# Altium project PreTriggerECAL.PrjPCB (part 2 of 3)
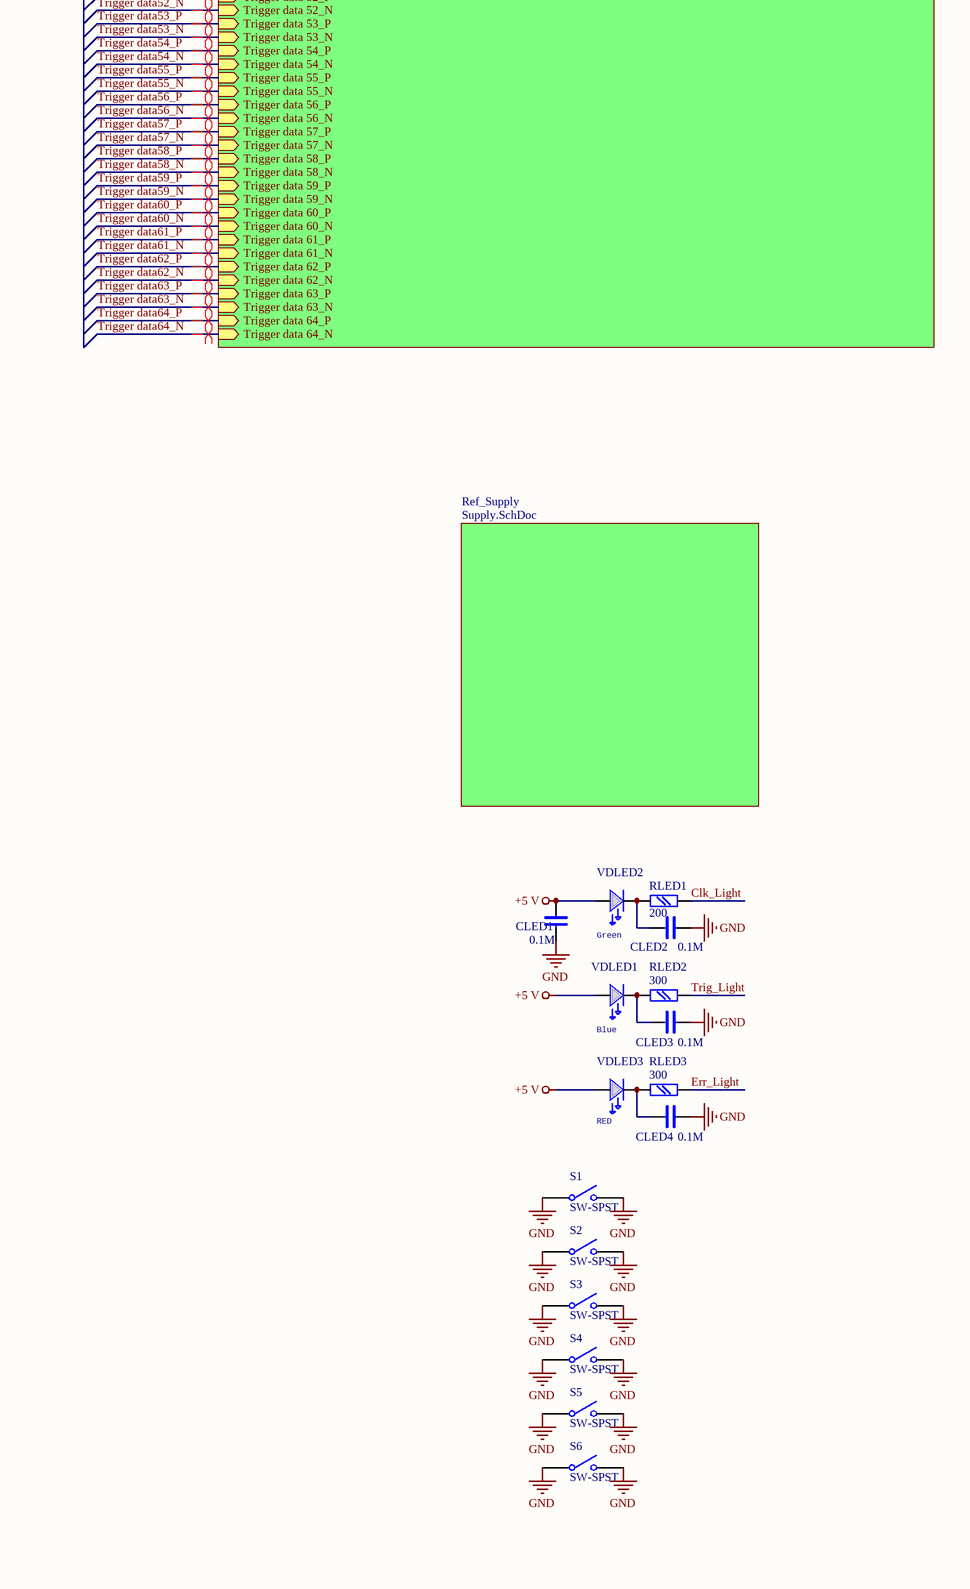
[diagram p14: Main_Trigger.SchDoc, bottom right]

## Sheet Main_Trigger.SchDoc (continued)

### Nets
+5 V: CLED1.1 VDLED1.ANOD VDLED2.ANOD VDLED3.ANOD
GND: CLED1.2 CLED2.2 CLED3.2 CLED4.2 FastTrig1.SHIELD S1.1(COMMON) S1.2(NO) S2.1(COMMON) S2.2(NO) S3.1(COMMON) S3.2(NO) S4.1(COMMON) S4.2(NO) S5.1(COMMON) S5.2(NO) S6.1(COMMON) S6.2(NO) TrigDes1.SHIELD
ADC_CLK: sheet Processing/ADC_CLK, sheet CLK/ADC_CLK
ADC_CSB: sheet Processing/ADC_CSB, sheet In_Ch1/CSB, sheet In_Ch2/CSB, sheet In_Ch3/CSB, sheet In_Ch4/CSB, sheet In_Ch5/CSB, sheet In_Ch6/CSB, sheet In_Ch7/CSB, sheet In_Ch8/CSB, sheet In_Ch9/CSB, sheet In_Ch16/CSB, sheet In_Ch15/CSB, sheet In_Ch14/CSB, sheet In_Ch13/CSB, sheet In_Ch12/CSB, sheet In_Ch11/CSB, sheet In_Ch10/CSB
ADC_DOWN_CLK_N: sheet In_Ch1/CLK_N, sheet In_Ch2/CLK_N, sheet In_Ch3/CLK_N, sheet In_Ch4/CLK_N, sheet In_Ch5/CLK_N, sheet In_Ch6/CLK_N, sheet In_Ch7/CLK_N, sheet In_Ch8/CLK_N, sheet CLK/ADC_DOWN_CLK_N
ADC_DOWN_CLK_P: sheet In_Ch1/CLK_P, sheet In_Ch2/CLK_P, sheet In_Ch3/CLK_P, sheet In_Ch4/CLK_P, sheet In_Ch5/CLK_P, sheet In_Ch6/CLK_P, sheet In_Ch7/CLK_P, sheet In_Ch8/CLK_P, sheet CLK/ADC_DOWN_CLK_P
ADC_SCLK: sheet Processing/ADC_SCLK, sheet In_Ch1/SCLK, sheet In_Ch2/SCLK, sheet In_Ch3/SCLK, sheet In_Ch4/SCLK, sheet In_Ch5/SCLK, sheet In_Ch6/SCLK, sheet In_Ch7/SCLK, sheet In_Ch8/SCLK, sheet In_Ch9/SCLK, sheet In_Ch16/SCLK, sheet In_Ch15/SCLK, sheet In_Ch14/SCLK, sheet In_Ch13/SCLK, sheet In_Ch12/SCLK, sheet In_Ch11/SCLK, sheet In_Ch10/SCLK
ADC_SDIO/ODM: sheet Processing/ADC_SDIO/ODM, sheet In_Ch1/SDIO/ODM, sheet In_Ch2/SDIO/ODM, sheet In_Ch3/SDIO/ODM, sheet In_Ch4/SDIO/ODM, sheet In_Ch5/SDIO/ODM, sheet In_Ch6/SDIO/ODM, sheet In_Ch7/SDIO/ODM, sheet In_Ch8/SDIO/ODM, sheet In_Ch9/SDIO/ODM, sheet In_Ch16/SDIO/ODM, sheet In_Ch15/SDIO/ODM, sheet In_Ch14/SDIO/ODM, sheet In_Ch13/SDIO/ODM, sheet In_Ch12/SDIO/ODM, sheet In_Ch11/SDIO/ODM, sheet In_Ch10/SDIO/ODM
ADC_UP_CLK_N: sheet In_Ch9/CLK_N, sheet In_Ch16/CLK_N, sheet In_Ch15/CLK_N, sheet In_Ch14/CLK_N, sheet In_Ch13/CLK_N, sheet In_Ch12/CLK_N, sheet In_Ch11/CLK_N, sheet In_Ch10/CLK_N, sheet CLK/ADC_UP_CLK_N
ADC_UP_CLK_P: sheet In_Ch9/CLK_P, sheet In_Ch16/CLK_P, sheet In_Ch15/CLK_P, sheet In_Ch14/CLK_P, sheet In_Ch13/CLK_P, sheet In_Ch12/CLK_P, sheet In_Ch11/CLK_P, sheet In_Ch10/CLK_P, sheet CLK/ADC_UP_CLK_P
Calib: sheet In_Ch1/Calib, sheet In_Ch2/Calib, sheet In_Ch3/Calib, sheet In_Ch4/Calib, sheet In_Ch5/Calib, sheet In_Ch6/Calib, sheet In_Ch7/Calib, sheet In_Ch8/Calib, sheet In_Ch9/Calib, sheet In_Ch16/Calib, sheet In_Ch15/Calib, sheet In_Ch14/Calib, sheet In_Ch13/Calib, sheet In_Ch12/Calib
Clk_Light: RLED1.2 ; sheet Processing/LED_Clock
COL: sheet Processing/COL, sheet Ethernet/COL
CRS: sheet Processing/CRS, sheet Ethernet/CRS
Err_Light: RLED3.2 ; sheet Processing/LED_Err
FastTrigDes: FastTrig1.WIRE ; sheet Processing/FastTrig
FCO_Next_N: sheet Processing/FCO_Next_N, sheet Next_Channels/FCO_Next_N
FCO_Next_P: sheet Processing/FCO_Next_P, sheet Next_Channels/FCO_Next_P
FCO_Prev_N: sheet Processing/FCO_Prev_N, sheet Prev_Channels/FCO_Prev_N
FCO_Prev_P: sheet Processing/FCO_Prev_P, sheet Prev_Channels/FCO_Prev_P
FCT_CLK: sheet Processing/FCT_CLK, sheet CLK/FCT_CLK
FCT_CLK_40MHz_N: sheet Processing/FCT_CLK_40MHz_N, sheet FCT_connector/FCT_CLK_40MHz_N
FCT_CLK_40MHz_P: sheet Processing/FCT_CLK_40MHz_P, sheet FCT_connector/FCT_CLK_40MHz_P
FCT_CLK_160MHz_N: sheet Processing/FCT_CLK_160MHz_N, sheet FCT_connector/FCT_CLK_160MHz_N
FCT_CLK_160MHz_P: sheet Processing/FCT_CLK_160MHz_P, sheet FCT_connector/FCT_CLK_160MHz_P
FQuartz: sheet Processing/Fquartz, sheet Ethernet/FQuartz, sheet CLK/FQuartz
NextCh1_N: sheet Processing/Next_DigCh1_N, sheet Next_Channels/TransCh1_N
NextCh1_P: sheet Processing/Next_DigCh1_P, sheet Next_Channels/TransCh1_P
NextCh2_N: sheet Processing/Next_DigCh2_N, sheet Next_Channels/TransCh2_N
NextCh2_P: sheet Processing/Next_DigCh2_P, sheet Next_Channels/TransCh2_P
NextCh3_N: sheet Processing/Next_DigCh3_N, sheet Next_Channels/TransCh3_N
NextCh3_P: sheet Processing/Next_DigCh3_P, sheet Next_Channels/TransCh3_P
NextCh4_N: sheet Processing/Next_DigCh4_N, sheet Next_Channels/TransCh4_N
NextCh4_P: sheet Processing/Next_DigCh4_P, sheet Next_Channels/TransCh4_P
NextCh5_N: sheet Processing/Next_DigCh5_N, sheet Next_Channels/TransCh5_N
NextCh5_P: sheet Processing/Next_DigCh5_P, sheet Next_Channels/TransCh5_P
NextCh6_N: sheet Processing/Next_DigCh6_N, sheet Next_Channels/TransCh6_N
NextCh6_P: sheet Processing/Next_DigCh6_P, sheet Next_Channels/TransCh6_P
NextCh7_N: sheet Processing/Next_DigCh7_N, sheet Next_Channels/TransCh7_N
NextCh7_P: sheet Processing/Next_DigCh7_P, sheet Next_Channels/TransCh7_P
NextCh8_N: sheet Processing/Next_DigCh8_N, sheet Next_Channels/TransCh8_N
NextCh8_P: sheet Processing/Next_DigCh8_P, sheet Next_Channels/TransCh8_P
NextCh9_N: sheet Processing/Next_DigCh9_N, sheet Next_Channels/TransCh9_N
NextCh9_P: sheet Processing/Next_DigCh9_P, sheet Next_Channels/TransCh9_P
NextCh10_N: sheet Processing/Next_DigCh10_N, sheet Next_Channels/TransCh10_N
NextCh10_P: sheet Processing/Next_DigCh10_P, sheet Next_Channels/TransCh10_P
NextCh11_N: sheet Processing/Next_DigCh11_N, sheet Next_Channels/TransCh11_N
NextCh11_P: sheet Processing/Next_DigCh11_P, sheet Next_Channels/TransCh11_P
NextCh12_N: sheet Processing/Next_DigCh12_N, sheet Next_Channels/TransCh12_N
NextCh12_P: sheet Processing/Next_DigCh12_P, sheet Next_Channels/TransCh12_P
Part1_InputCh1_N: sheet Processing/Part1_DigCh1_N, sheet In_Ch1/InputCh1_N
Part1_InputCh1_P: sheet Processing/Part1_DigCh1_P, sheet In_Ch1/InputCh1_P
Part1_InputCh2_N: sheet Processing/Part1_DigCh2_N, sheet In_Ch1/InputCh2_N
Part1_InputCh2_P: sheet Processing/Part1_DigCh2_P, sheet In_Ch1/InputCh2_P
Part1_InputCh3_N: sheet Processing/Part1_DigCh3_N, sheet In_Ch1/InputCh3_N
Part1_InputCh3_P: sheet Processing/Part1_DigCh3_P, sheet In_Ch1/InputCh3_P
Part1_InputCh4_N: sheet Processing/Part1_DigCh4_N, sheet In_Ch1/InputCh4_N
Part1_InputCh4_P: sheet Processing/Part1_DigCh4_P, sheet In_Ch1/InputCh4_P
Part1_InputCh5_N: sheet Processing/Part1_DigCh5_N, sheet In_Ch1/InputCh5_N
Part1_InputCh5_P: sheet Processing/Part1_DigCh5_P, sheet In_Ch1/InputCh5_P
Part1_InputCh6_N: sheet Processing/Part1_DigCh6_N, sheet In_Ch1/InputCh6_N
Part1_InputCh6_P: sheet Processing/Part1_DigCh6_P, sheet In_Ch1/InputCh6_P
Part1_InputCh7_N: sheet Processing/Part1_DigCh7_N, sheet In_Ch1/InputCh7_N
Part1_InputCh7_P: sheet Processing/Part1_DigCh7_P, sheet In_Ch1/InputCh7_P
Part1_InputCh8_N: sheet Processing/Part1_DigCh8_N, sheet In_Ch1/InputCh8_N
Part1_InputCh8_P: sheet Processing/Part1_DigCh8_P, sheet In_Ch1/InputCh8_P
Part2_InputCh1_N: sheet Processing/Part2_DigCh1_N, sheet In_Ch2/InputCh1_N
Part2_InputCh1_P: sheet Processing/Part2_DigCh1_P, sheet In_Ch2/InputCh1_P
Part2_InputCh2_N: sheet Processing/Part2_DigCh2_N, sheet In_Ch2/InputCh2_N
Part2_InputCh2_P: sheet Processing/Part2_DigCh2_P, sheet In_Ch2/InputCh2_P
Part2_InputCh3_N: sheet Processing/Part2_DigCh3_N, sheet In_Ch2/InputCh3_N
Part2_InputCh3_P: sheet Processing/Part2_DigCh3_P, sheet In_Ch2/InputCh3_P
Part2_InputCh4_N: sheet Processing/Part2_DigCh4_N, sheet In_Ch2/InputCh4_N
Part2_InputCh4_P: sheet Processing/Part2_DigCh4_P, sheet In_Ch2/InputCh4_P
Part2_InputCh5_N: sheet Processing/Part2_DigCh5_N, sheet In_Ch2/InputCh5_N
Part2_InputCh5_P: sheet Processing/Part2_DigCh5_P, sheet In_Ch2/InputCh5_P
Part2_InputCh6_N: sheet Processing/Part2_DigCh6_N, sheet In_Ch2/InputCh6_N
Part2_InputCh6_P: sheet Processing/Part2_DigCh6_P, sheet In_Ch2/InputCh6_P
Part2_InputCh7_N: sheet Processing/Part2_DigCh7_N, sheet In_Ch2/InputCh7_N
Part2_InputCh7_P: sheet Processing/Part2_DigCh7_P, sheet In_Ch2/InputCh7_P
Part2_InputCh8_N: sheet Processing/Part2_DigCh8_N, sheet In_Ch2/InputCh8_N
Part2_InputCh8_P: sheet Processing/Part2_DigCh8_P, sheet In_Ch2/InputCh8_P
Part3_InputCh1_N: sheet Processing/Part3_DigCh1_N, sheet In_Ch3/InputCh1_N
Part3_InputCh1_P: sheet Processing/Part3_DigCh1_P, sheet In_Ch3/InputCh1_P
Part3_InputCh2_N: sheet Processing/Part3_DigCh2_N, sheet In_Ch3/InputCh2_N
Part3_InputCh2_P: sheet Processing/Part3_DigCh2_P, sheet In_Ch3/InputCh2_P
Part3_InputCh3_N: sheet Processing/Part3_DigCh3_N, sheet In_Ch3/InputCh3_N
Part3_InputCh3_P: sheet Processing/Part3_DigCh3_P, sheet In_Ch3/InputCh3_P
Part3_InputCh4_N: sheet Processing/Part3_DigCh4_N, sheet In_Ch3/InputCh4_N
Part3_InputCh4_P: sheet Processing/Part3_DigCh4_P, sheet In_Ch3/InputCh4_P
Part3_InputCh5_N: sheet Processing/Part3_DigCh5_N, sheet In_Ch3/InputCh5_N
Part3_InputCh5_P: sheet Processing/Part3_DigCh5_P, sheet In_Ch3/InputCh5_P
Part3_InputCh6_N: sheet Processing/Part3_DigCh6_N, sheet In_Ch3/InputCh6_N
Part3_InputCh6_P: sheet Processing/Part3_DigCh6_P, sheet In_Ch3/InputCh6_P
Part3_InputCh7_N: sheet Processing/Part3_DigCh7_N, sheet In_Ch3/InputCh7_N
Part3_InputCh7_P: sheet Processing/Part3_DigCh7_P, sheet In_Ch3/InputCh7_P
Part3_InputCh8_N: sheet Processing/Part3_DigCh8_N, sheet In_Ch3/InputCh8_N
Part3_InputCh8_P: sheet Processing/Part3_DigCh8_P, sheet In_Ch3/InputCh8_P
Part4_InputCh1_N: sheet Processing/Part4_DigCh1_N, sheet In_Ch4/InputCh1_N
Part4_InputCh1_P: sheet Processing/Part4_DigCh1_P, sheet In_Ch4/InputCh1_P
Part4_InputCh2_N: sheet Processing/Part4_DigCh2_N, sheet In_Ch4/InputCh2_N
Part4_InputCh2_P: sheet Processing/Part4_DigCh2_P, sheet In_Ch4/InputCh2_P
Part4_InputCh3_N: sheet Processing/Part4_DigCh3_N, sheet In_Ch4/InputCh3_N
Part4_InputCh3_P: sheet Processing/Part4_DigCh3_P, sheet In_Ch4/InputCh3_P
Part4_InputCh4_N: sheet Processing/Part4_DigCh4_N, sheet In_Ch4/InputCh4_N
Part4_InputCh4_P: sheet Processing/Part4_DigCh4_P, sheet In_Ch4/InputCh4_P
Part4_InputCh5_N: sheet Processing/Part4_DigCh5_N, sheet In_Ch4/InputCh5_N
Part4_InputCh5_P: sheet Processing/Part4_DigCh5_P, sheet In_Ch4/InputCh5_P
Part4_InputCh6_N: sheet Processing/Part4_DigCh6_N, sheet In_Ch4/InputCh6_N
Part4_InputCh6_P: sheet Processing/Part4_DigCh6_P, sheet In_Ch4/InputCh6_P
Part4_InputCh7_N: sheet Processing/Part4_DigCh7_N, sheet In_Ch4/InputCh7_N
Part4_InputCh7_P: sheet Processing/Part4_DigCh7_P, sheet In_Ch4/InputCh7_P
Part4_InputCh8_N: sheet Processing/Part4_DigCh8_N, sheet In_Ch4/InputCh8_N
Part4_InputCh8_P: sheet Processing/Part4_DigCh8_P, sheet In_Ch4/InputCh8_P
Part5_InputCh1_N: sheet Processing/Part5_DigCh1_N, sheet In_Ch5/InputCh1_N
Part5_InputCh1_P: sheet Processing/Part5_DigCh1_P, sheet In_Ch5/InputCh1_P
Part5_InputCh2_N: sheet Processing/Part5_DigCh2_N, sheet In_Ch5/InputCh2_N
Part5_InputCh2_P: sheet Processing/Part5_DigCh2_P, sheet In_Ch5/InputCh2_P
Part5_InputCh3_N: sheet Processing/Part5_DigCh3_N, sheet In_Ch5/InputCh3_N
Part5_InputCh3_P: sheet Processing/Part5_DigCh3_P, sheet In_Ch5/InputCh3_P
Part5_InputCh4_N: sheet Processing/Part5_DigCh4_N, sheet In_Ch5/InputCh4_N
Part5_InputCh4_P: sheet Processing/Part5_DigCh4_P, sheet In_Ch5/InputCh4_P
Part5_InputCh5_N: sheet Processing/Part5_DigCh5_N, sheet In_Ch5/InputCh5_N
Part5_InputCh5_P: sheet Processing/Part5_DigCh5_P, sheet In_Ch5/InputCh5_P
Part5_InputCh6_N: sheet Processing/Part5_DigCh6_N, sheet In_Ch5/InputCh6_N
Part5_InputCh6_P: sheet Processing/Part5_DigCh6_P, sheet In_Ch5/InputCh6_P
Part5_InputCh7_N: sheet Processing/Part5_DigCh7_N, sheet In_Ch5/InputCh7_N
Part5_InputCh7_P: sheet Processing/Part5_DigCh7_P, sheet In_Ch5/InputCh7_P
Part5_InputCh8_N: sheet Processing/Part5_DigCh8_N, sheet In_Ch5/InputCh8_N
Part5_InputCh8_P: sheet Processing/Part5_DigCh8_P, sheet In_Ch5/InputCh8_P
Part6_InputCh1_N: sheet Processing/Part6_DigCh1_N, sheet In_Ch6/InputCh1_N
Part6_InputCh1_P: sheet Processing/Part6_DigCh1_P, sheet In_Ch6/InputCh1_P
Part6_InputCh2_N: sheet Processing/Part6_DigCh2_N, sheet In_Ch6/InputCh2_N
Part6_InputCh2_P: sheet Processing/Part6_DigCh2_P, sheet In_Ch6/InputCh2_P
Part6_InputCh3_N: sheet Processing/Part6_DigCh3_N, sheet In_Ch6/InputCh3_N
Part6_InputCh3_P: sheet Processing/Part6_DigCh3_P, sheet In_Ch6/InputCh3_P
Part6_InputCh4_N: sheet Processing/Part6_DigCh4_N, sheet In_Ch6/InputCh4_N
Part6_InputCh4_P: sheet Processing/Part6_DigCh4_P, sheet In_Ch6/InputCh4_P
Part6_InputCh5_N: sheet Processing/Part6_DigCh5_N, sheet In_Ch6/InputCh5_N
Part6_InputCh5_P: sheet Processing/Part6_DigCh5_P, sheet In_Ch6/InputCh5_P
Part6_InputCh6_N: sheet Processing/Part6_DigCh6_N, sheet In_Ch6/InputCh6_N
Part6_InputCh6_P: sheet Processing/Part6_DigCh6_P, sheet In_Ch6/InputCh6_P
Part6_InputCh7_N: sheet Processing/Part6_DigCh7_N, sheet In_Ch6/InputCh7_N
Part6_InputCh7_P: sheet Processing/Part6_DigCh7_P, sheet In_Ch6/InputCh7_P
Part6_InputCh8_N: sheet Processing/Part6_DigCh8_N, sheet In_Ch6/InputCh8_N
Part6_InputCh8_P: sheet Processing/Part6_DigCh8_P, sheet In_Ch6/InputCh8_P
Part7_InputCh1_N: sheet Processing/Part7_DigCh1_N, sheet In_Ch7/InputCh1_N
Part7_InputCh1_P: sheet Processing/Part7_DigCh1_P, sheet In_Ch7/InputCh1_P
Part7_InputCh2_N: sheet Processing/Part7_DigCh2_N, sheet In_Ch7/InputCh2_N
Part7_InputCh2_P: sheet Processing/Part7_DigCh2_P, sheet In_Ch7/InputCh2_P
Part7_InputCh3_N: sheet Processing/Part7_DigCh3_N, sheet In_Ch7/InputCh3_N
Part7_InputCh3_P: sheet Processing/Part7_DigCh3_P, sheet In_Ch7/InputCh3_P
Part7_InputCh4_N: sheet Processing/Part7_DigCh4_N, sheet In_Ch7/InputCh4_N
Part7_InputCh4_P: sheet Processing/Part7_DigCh4_P, sheet In_Ch7/InputCh4_P
Part7_InputCh5_N: sheet Processing/Part7_DigCh5_N, sheet In_Ch7/InputCh5_N
Part7_InputCh5_P: sheet Processing/Part7_DigCh5_P, sheet In_Ch7/InputCh5_P
Part7_InputCh6_N: sheet Processing/Part7_DigCh6_N, sheet In_Ch7/InputCh6_N
Part7_InputCh6_P: sheet Processing/Part7_DigCh6_P, sheet In_Ch7/InputCh6_P
Part7_InputCh7_N: sheet Processing/Part7_DigCh7_N, sheet In_Ch7/InputCh7_N
Part7_InputCh7_P: sheet Processing/Part7_DigCh7_P, sheet In_Ch7/InputCh7_P
Part7_InputCh8_N: sheet Processing/Part7_DigCh8_N, sheet In_Ch7/InputCh8_N
Part7_InputCh8_P: sheet Processing/Part7_DigCh8_P, sheet In_Ch7/InputCh8_P
Part8_InputCh1_N: sheet Processing/Part8_DigCh1_N, sheet In_Ch8/InputCh1_N
Part8_InputCh1_P: sheet Processing/Part8_DigCh1_P, sheet In_Ch8/InputCh1_P
Part8_InputCh2_N: sheet Processing/Part8_DigCh2_N, sheet In_Ch8/InputCh2_N
Part8_InputCh2_P: sheet Processing/Part8_DigCh2_P, sheet In_Ch8/InputCh2_P
Part8_InputCh3_N: sheet Processing/Part8_DigCh3_N, sheet In_Ch8/InputCh3_N
Part8_InputCh3_P: sheet Processing/Part8_DigCh3_P, sheet In_Ch8/InputCh3_P
Part8_InputCh4_N: sheet Processing/Part8_DigCh4_N, sheet In_Ch8/InputCh4_N
Part8_InputCh4_P: sheet Processing/Part8_DigCh4_P, sheet In_Ch8/InputCh4_P
Part8_InputCh5_N: sheet Processing/Part8_DigCh5_N, sheet In_Ch8/InputCh5_N
Part8_InputCh5_P: sheet Processing/Part8_DigCh5_P, sheet In_Ch8/InputCh5_P
Part8_InputCh6_N: sheet Processing/Part8_DigCh6_N, sheet In_Ch8/InputCh6_N
Part8_InputCh6_P: sheet Processing/Part8_DigCh6_P, sheet In_Ch8/InputCh6_P
Part8_InputCh7_N: sheet Processing/Part8_DigCh7_N, sheet In_Ch8/InputCh7_N
Part8_InputCh7_P: sheet Processing/Part8_DigCh7_P, sheet In_Ch8/InputCh7_P
Part8_InputCh8_N: sheet Processing/Part8_DigCh8_N, sheet In_Ch8/InputCh8_N
Part8_InputCh8_P: sheet Processing/Part8_DigCh8_P, sheet In_Ch8/InputCh8_P
Part9_InputCh1_N: sheet Processing/Part9_DigCh1_N, sheet In_Ch9/InputCh1_N
Part9_InputCh1_P: sheet Processing/Part9_DigCh1_P, sheet In_Ch9/InputCh1_P
Part9_InputCh2_N: sheet Processing/Part9_DigCh2_N, sheet In_Ch9/InputCh2_N
Part9_InputCh2_P: sheet Processing/Part9_DigCh2_P, sheet In_Ch9/InputCh2_P
Part9_InputCh3_N: sheet Processing/Part9_DigCh3_N, sheet In_Ch9/InputCh3_N
Part9_InputCh3_P: sheet Processing/Part9_DigCh3_P, sheet In_Ch9/InputCh3_P
Part9_InputCh4_N: sheet Processing/Part9_DigCh4_N, sheet In_Ch9/InputCh4_N
Part9_InputCh4_P: sheet Processing/Part9_DigCh4_P, sheet In_Ch9/InputCh4_P
Part9_InputCh5_N: sheet Processing/Part9_DigCh5_N, sheet In_Ch9/InputCh5_N
Part9_InputCh5_P: sheet Processing/Part9_DigCh5_P, sheet In_Ch9/InputCh5_P
Part9_InputCh6_N: sheet Processing/Part9_DigCh6_N, sheet In_Ch9/InputCh6_N
Part9_InputCh6_P: sheet Processing/Part9_DigCh6_P, sheet In_Ch9/InputCh6_P
Part9_InputCh7_N: sheet Processing/Part9_DigCh7_N, sheet In_Ch9/InputCh7_N
Part9_InputCh7_P: sheet Processing/Part9_DigCh7_P, sheet In_Ch9/InputCh7_P
Part9_InputCh8_N: sheet Processing/Part9_DigCh8_N, sheet In_Ch9/InputCh8_N
Part9_InputCh8_P: sheet Processing/Part9_DigCh8_P, sheet In_Ch9/InputCh8_P
Part10_InputCh1_N: sheet Processing/Part10_DigCh1_N, sheet In_Ch10/InputCh1_N
Part10_InputCh1_P: sheet Processing/Part10_DigCh1_P, sheet In_Ch10/InputCh1_P
Part10_InputCh2_N: sheet Processing/Part10_DigCh2_N, sheet In_Ch10/InputCh2_N
Part10_InputCh2_P: sheet Processing/Part10_DigCh2_P, sheet In_Ch10/InputCh2_P
Part10_InputCh3_N: sheet Processing/Part10_DigCh3_N, sheet In_Ch10/InputCh3_N
Part10_InputCh3_P: sheet Processing/Part10_DigCh3_P, sheet In_Ch10/InputCh3_P
Part10_InputCh4_N: sheet Processing/Part10_DigCh4_N, sheet In_Ch10/InputCh4_N
Part10_InputCh4_P: sheet Processing/Part10_DigCh4_P, sheet In_Ch10/InputCh4_P
Part10_InputCh5_N: sheet Processing/Part10_DigCh5_N, sheet In_Ch10/InputCh5_N
Part10_InputCh5_P: sheet Processing/Part10_DigCh5_P, sheet In_Ch10/InputCh5_P
Part10_InputCh6_N: sheet Processing/Part10_DigCh6_N, sheet In_Ch10/InputCh6_N
Part10_InputCh6_P: sheet Processing/Part10_DigCh6_P, sheet In_Ch10/InputCh6_P
Part10_InputCh7_N: sheet Processing/Part10_DigCh7_N, sheet In_Ch10/InputCh7_N
Part10_InputCh7_P: sheet Processing/Part10_DigCh7_P, sheet In_Ch10/InputCh7_P
Part10_InputCh8_N: sheet Processing/Part10_DigCh8_N, sheet In_Ch10/InputCh8_N
Part10_InputCh8_P: sheet Processing/Part10_DigCh8_P, sheet In_Ch10/InputCh8_P
Part11_InputCh1_N: sheet Processing/Part11_DigCh1_N, sheet In_Ch11/InputCh1_N
Part11_InputCh1_P: sheet Processing/Part11_DigCh1_P, sheet In_Ch11/InputCh1_P
Part11_InputCh2_N: sheet Processing/Part11_DigCh2_N, sheet In_Ch11/InputCh2_N
Part11_InputCh2_P: sheet Processing/Part11_DigCh2_P, sheet In_Ch11/InputCh2_P
Part11_InputCh3_N: sheet Processing/Part11_DigCh3_N, sheet In_Ch11/InputCh3_N
Part11_InputCh3_P: sheet Processing/Part11_DigCh3_P, sheet In_Ch11/InputCh3_P
Part11_InputCh4_N: sheet Processing/Part11_DigCh4_N, sheet In_Ch11/InputCh4_N
Part11_InputCh4_P: sheet Processing/Part11_DigCh4_P, sheet In_Ch11/InputCh4_P
Part11_InputCh5_N: sheet Processing/Part11_DigCh5_N, sheet In_Ch11/InputCh5_N
Part11_InputCh5_P: sheet Processing/Part11_DigCh5_P, sheet In_Ch11/InputCh5_P
Part11_InputCh6_N: sheet Processing/Part11_DigCh6_N, sheet In_Ch11/InputCh6_N
Part11_InputCh6_P: sheet Processing/Part11_DigCh6_P, sheet In_Ch11/InputCh6_P
Part11_InputCh7_N: sheet Processing/Part11_DigCh7_N, sheet In_Ch11/InputCh7_N
Part11_InputCh7_P: sheet Processing/Part11_DigCh7_P, sheet In_Ch11/InputCh7_P
Part11_InputCh8_N: sheet Processing/Part11_DigCh8_N, sheet In_Ch11/InputCh8_N
Part11_InputCh8_P: sheet Processing/Part11_DigCh8_P, sheet In_Ch11/InputCh8_P
Part12_InputCh1_N: sheet Processing/Part12_DigCh1_N, sheet In_Ch12/InputCh1_N
Part12_InputCh1_P: sheet Processing/Part12_DigCh1_P, sheet In_Ch12/InputCh1_P
Part12_InputCh2_N: sheet Processing/Part12_DigCh2_N, sheet In_Ch12/InputCh2_N
Part12_InputCh2_P: sheet Processing/Part12_DigCh2_P, sheet In_Ch12/InputCh2_P
Part12_InputCh3_N: sheet Processing/Part12_DigCh3_N, sheet In_Ch12/InputCh3_N
Part12_InputCh3_P: sheet Processing/Part12_DigCh3_P, sheet In_Ch12/InputCh3_P
Part12_InputCh4_N: sheet Processing/Part12_DigCh4_N, sheet In_Ch12/InputCh4_N
Part12_InputCh4_P: sheet Processing/Part12_DigCh4_P, sheet In_Ch12/InputCh4_P
Part12_InputCh5_N: sheet Processing/Part12_DigCh5_N, sheet In_Ch12/InputCh5_N
Part12_InputCh5_P: sheet Processing/Part12_DigCh5_P, sheet In_Ch12/InputCh5_P
Part12_InputCh6_N: sheet Processing/Part12_DigCh6_N, sheet In_Ch12/InputCh6_N
Part12_InputCh6_P: sheet Processing/Part12_DigCh6_P, sheet In_Ch12/InputCh6_P
Part12_InputCh7_N: sheet Processing/Part12_DigCh7_N, sheet In_Ch12/InputCh7_N
Part12_InputCh7_P: sheet Processing/Part12_DigCh7_P, sheet In_Ch12/InputCh7_P
Part12_InputCh8_N: sheet Processing/Part12_DigCh8_N, sheet In_Ch12/InputCh8_N
Part12_InputCh8_P: sheet Processing/Part12_DigCh8_P, sheet In_Ch12/InputCh8_P
Part13_InputCh1_N: sheet Processing/Part13_DigCh1_N, sheet In_Ch13/InputCh1_N
Part13_InputCh1_P: sheet Processing/Part13_DigCh1_P, sheet In_Ch13/InputCh1_P
Part13_InputCh2_N: sheet Processing/Part13_DigCh2_N, sheet In_Ch13/InputCh2_N
Part13_InputCh2_P: sheet Processing/Part13_DigCh2_P, sheet In_Ch13/InputCh2_P
Part13_InputCh3_N: sheet Processing/Part13_DigCh3_N, sheet In_Ch13/InputCh3_N
Part13_InputCh3_P: sheet Processing/Part13_DigCh3_P, sheet In_Ch13/InputCh3_P
Part13_InputCh4_N: sheet Processing/Part13_DigCh4_N, sheet In_Ch13/InputCh4_N
Part13_InputCh4_P: sheet Processing/Part13_DigCh4_P, sheet In_Ch13/InputCh4_P
Part13_InputCh5_N: sheet Processing/Part13_DigCh5_N, sheet In_Ch13/InputCh5_N
Part13_InputCh5_P: sheet Processing/Part13_DigCh5_P, sheet In_Ch13/InputCh5_P
Part13_InputCh6_N: sheet Processing/Part13_DigCh6_N, sheet In_Ch13/InputCh6_N
Part13_InputCh6_P: sheet Processing/Part13_DigCh6_P, sheet In_Ch13/InputCh6_P
Part13_InputCh7_N: sheet Processing/Part13_DigCh7_N, sheet In_Ch13/InputCh7_N
Part13_InputCh7_P: sheet Processing/Part13_DigCh7_P, sheet In_Ch13/InputCh7_P
Part13_InputCh8_N: sheet Processing/Part13_DigCh8_N, sheet In_Ch13/InputCh8_N
Part13_InputCh8_P: sheet Processing/Part13_DigCh8_P, sheet In_Ch13/InputCh8_P
Part14_InputCh1_N: sheet Processing/Part14_DigCh1_N, sheet In_Ch14/InputCh1_N
Part14_InputCh1_P: sheet Processing/Part14_DigCh1_P, sheet In_Ch14/InputCh1_P
Part14_InputCh2_N: sheet Processing/Part14_DigCh2_N, sheet In_Ch14/InputCh2_N
Part14_InputCh2_P: sheet Processing/Part14_DigCh2_P, sheet In_Ch14/InputCh2_P
Part14_InputCh3_N: sheet Processing/Part14_DigCh3_N, sheet In_Ch14/InputCh3_N
Part14_InputCh3_P: sheet Processing/Part14_DigCh3_P, sheet In_Ch14/InputCh3_P
Part14_InputCh4_N: sheet Processing/Part14_DigCh4_N, sheet In_Ch14/InputCh4_N
Part14_InputCh4_P: sheet Processing/Part14_DigCh4_P, sheet In_Ch14/InputCh4_P
Part14_InputCh5_N: sheet Processing/Part14_DigCh5_N, sheet In_Ch14/InputCh5_N
Part14_InputCh5_P: sheet Processing/Part14_DigCh5_P, sheet In_Ch14/InputCh5_P
Part14_InputCh6_N: sheet Processing/Part14_DigCh6_N, sheet In_Ch14/InputCh6_N
Part14_InputCh6_P: sheet Processing/Part14_DigCh6_P, sheet In_Ch14/InputCh6_P
Part14_InputCh7_N: sheet Processing/Part14_DigCh7_N, sheet In_Ch14/InputCh7_N
Part14_InputCh7_P: sheet Processing/Part14_DigCh7_P, sheet In_Ch14/InputCh7_P
Part14_InputCh8_N: sheet Processing/Part14_DigCh8_N, sheet In_Ch14/InputCh8_N
Part14_InputCh8_P: sheet Processing/Part14_DigCh8_P, sheet In_Ch14/InputCh8_P
Part15_InputCh1_N: sheet Processing/Part15_DigCh1_N, sheet In_Ch15/InputCh1_N
Part15_InputCh1_P: sheet Processing/Part15_DigCh1_P, sheet In_Ch15/InputCh1_P
Part15_InputCh2_N: sheet Processing/Part15_DigCh2_N, sheet In_Ch15/InputCh2_N
Part15_InputCh2_P: sheet Processing/Part15_DigCh2_P, sheet In_Ch15/InputCh2_P
Part15_InputCh3_N: sheet Processing/Part15_DigCh3_N, sheet In_Ch15/InputCh3_N
Part15_InputCh3_P: sheet Processing/Part15_DigCh3_P, sheet In_Ch15/InputCh3_P
Part15_InputCh4_N: sheet Processing/Part15_DigCh4_N, sheet In_Ch15/InputCh4_N
Part15_InputCh4_P: sheet Processing/Part15_DigCh4_P, sheet In_Ch15/InputCh4_P
Part15_InputCh5_N: sheet Processing/Part15_DigCh5_N, sheet In_Ch15/InputCh5_N
Part15_InputCh5_P: sheet Processing/Part15_DigCh5_P, sheet In_Ch15/InputCh5_P
Part15_InputCh6_N: sheet Processing/Part15_DigCh6_N, sheet In_Ch15/InputCh6_N
Part15_InputCh6_P: sheet Processing/Part15_DigCh6_P, sheet In_Ch15/InputCh6_P
Part15_InputCh7_N: sheet Processing/Part15_DigCh7_N, sheet In_Ch15/InputCh7_N
Part15_InputCh7_P: sheet Processing/Part15_DigCh7_P, sheet In_Ch15/InputCh7_P
Part15_InputCh8_N: sheet Processing/Part15_DigCh8_N, sheet In_Ch15/InputCh8_N
Part15_InputCh8_P: sheet Processing/Part15_DigCh8_P, sheet In_Ch15/InputCh8_P
Part16_InputCh1_N: sheet Processing/Part16_DigCh1_N, sheet In_Ch16/InputCh1_N
Part16_InputCh1_P: sheet Processing/Part16_DigCh1_P, sheet In_Ch16/InputCh1_P
Part16_InputCh2_N: sheet Processing/Part16_DigCh2_N, sheet In_Ch16/InputCh2_N
Part16_InputCh2_P: sheet Processing/Part16_DigCh2_P, sheet In_Ch16/InputCh2_P
Part16_InputCh3_N: sheet Processing/Part16_DigCh3_N, sheet In_Ch16/InputCh3_N
Part16_InputCh3_P: sheet Processing/Part16_DigCh3_P, sheet In_Ch16/InputCh3_P
Part16_InputCh4_N: sheet Processing/Part16_DigCh4_N, sheet In_Ch16/InputCh4_N
Part16_InputCh4_P: sheet Processing/Part16_DigCh4_P, sheet In_Ch16/InputCh4_P
Part16_InputCh5_N: sheet Processing/Part16_DigCh5_N, sheet In_Ch16/InputCh5_N
Part16_InputCh5_P: sheet Processing/Part16_DigCh5_P, sheet In_Ch16/InputCh5_P
Part16_InputCh6_N: sheet Processing/Part16_DigCh6_N, sheet In_Ch16/InputCh6_N
Part16_InputCh6_P: sheet Processing/Part16_DigCh6_P, sheet In_Ch16/InputCh6_P
Part16_InputCh7_N: sheet Processing/Part16_DigCh7_N, sheet In_Ch16/InputCh7_N
Part16_InputCh7_P: sheet Processing/Part16_DigCh7_P, sheet In_Ch16/InputCh7_P
Part16_InputCh8_N: sheet Processing/Part16_DigCh8_N, sheet In_Ch16/InputCh8_N
Part16_InputCh8_P: sheet Processing/Part16_DigCh8_P, sheet In_Ch16/InputCh8_P
PLL_CLK: sheet Processing/PLL_CLK, sheet CLK/PLL_CLK
PrevCh1_N: sheet Processing/Prev_DigCh1_N, sheet Prev_Channels/TransCh1_N
PrevCh1_P: sheet Processing/Prev_DigCh1_P, sheet Prev_Channels/TransCh1_P
PrevCh2_N: sheet Processing/Prev_DigCh2_N, sheet Prev_Channels/TransCh2_N
PrevCh2_P: sheet Processing/Prev_DigCh2_P, sheet Prev_Channels/TransCh2_P
PrevCh3_N: sheet Processing/Prev_DigCh3_N, sheet Prev_Channels/TransCh3_N
PrevCh3_P: sheet Processing/Prev_DigCh3_P, sheet Prev_Channels/TransCh3_P
PrevCh4_N: sheet Processing/Prev_DigCh4_N, sheet Prev_Channels/TransCh4_N
PrevCh4_P: sheet Processing/Prev_DigCh4_P, sheet Prev_Channels/TransCh4_P
PrevCh5_N: sheet Processing/Prev_DigCh5_N, sheet Prev_Channels/TransCh5_N
PrevCh5_P: sheet Processing/Prev_DigCh5_P, sheet Prev_Channels/TransCh5_P
PrevCh6_N: sheet Processing/Prev_DigCh6_N, sheet Prev_Channels/TransCh6_N
PrevCh6_P: sheet Processing/Prev_DigCh6_P, sheet Prev_Channels/TransCh6_P
PrevCh7_N: sheet Processing/Prev_DigCh7_N, sheet Prev_Channels/TransCh7_N
PrevCh7_P: sheet Processing/Prev_DigCh7_P, sheet Prev_Channels/TransCh7_P
PrevCh8_N: sheet Processing/Prev_DigCh8_N, sheet Prev_Channels/TransCh8_N
PrevCh8_P: sheet Processing/Prev_DigCh8_P, sheet Prev_Channels/TransCh8_P
PrevCh9_N: sheet Processing/Prev_DigCh9_N, sheet Prev_Channels/TransCh9_N
PrevCh9_P: sheet Processing/Prev_DigCh9_P, sheet Prev_Channels/TransCh9_P
PrevCh10_N: sheet Processing/Prev_DigCh10_N, sheet Prev_Channels/TransCh10_N
PrevCh10_P: sheet Processing/Prev_DigCh10_P, sheet Prev_Channels/TransCh10_P
PrevCh11_N: sheet Processing/Prev_DigCh11_N, sheet Prev_Channels/TransCh11_N
PrevCh11_P: sheet Processing/Prev_DigCh11_P, sheet Prev_Channels/TransCh11_P
PrevCh12_N: sheet Processing/Prev_DigCh12_N, sheet Prev_Channels/TransCh12_N
PrevCh12_P: sheet Processing/Prev_DigCh12_P, sheet Prev_Channels/TransCh12_P
RX_CLK: sheet Processing/RX_CLK, sheet Ethernet/RX_CLK
RX_DV: sheet Processing/RX_DV, sheet Ethernet/RX_DV
SW_FCT-CLK: sheet Processing/SW_FCT-CLK, sheet CLK/SW_FCT-CLK
SW_Quartz: sheet Processing/SW_Quartz, sheet CLK/SW_Quartz
Trig_Light: RLED2.2 ; sheet Processing/LED_Trig
TrigDes: TrigDes1.WIRE ; sheet Processing/TrigDes
Trigger data1_N: sheet Processing/Trigger data 1_N, sheet FCT_connector/Trigger data 1_N
Trigger data1_P: sheet Processing/Trigger data 1_P, sheet FCT_connector/Trigger data 1_P
Trigger data2_N: sheet Processing/Trigger data 2_N, sheet FCT_connector/Trigger data 2_N
Trigger data2_P: sheet Processing/Trigger data 2_P, sheet FCT_connector/Trigger data 2_P
Trigger data3_N: sheet Processing/Trigger data 3_N, sheet FCT_connector/Trigger data 3_N
Trigger data3_P: sheet Processing/Trigger data 3_P, sheet FCT_connector/Trigger data 3_P
Trigger data4_N: sheet Processing/Trigger data 4_N, sheet FCT_connector/Trigger data 4_N
Trigger data4_P: sheet Processing/Trigger data 4_P, sheet FCT_connector/Trigger data 4_P
Trigger data5_N: sheet Processing/Trigger data 5_N, sheet FCT_connector/Trigger data 5_N
Trigger data5_P: sheet Processing/Trigger data 5_P, sheet FCT_connector/Trigger data 5_P
Trigger data6_N: sheet Processing/Trigger data 6_N, sheet FCT_connector/Trigger data 6_N
Trigger data6_P: sheet Processing/Trigger data 6_P, sheet FCT_connector/Trigger data 6_P
Trigger data7_N: sheet Processing/Trigger data 7_N, sheet FCT_connector/Trigger data 7_N
Trigger data7_P: sheet Processing/Trigger data 7_P, sheet FCT_connector/Trigger data 7_P
Trigger data8_N: sheet Processing/Trigger data 8_N, sheet FCT_connector/Trigger data 8_N
Trigger data8_P: sheet Processing/Trigger data 8_P, sheet FCT_connector/Trigger data 8_P
Trigger data9_N: sheet Processing/Trigger data 9_N, sheet FCT_connector/Trigger data 9_N
Trigger data9_P: sheet Processing/Trigger data 9_P, sheet FCT_connector/Trigger data 9_P
Trigger data10_N: sheet Processing/Trigger data 10_N, sheet FCT_connector/Trigger data 10_N
Trigger data10_P: sheet Processing/Trigger data 10_P, sheet FCT_connector/Trigger data 10_P
Trigger data11_N: sheet Processing/Trigger data 11_N, sheet FCT_connector/Trigger data 11_N
Trigger data11_P: sheet Processing/Trigger data 11_P, sheet FCT_connector/Trigger data 11_P
Trigger data12_N: sheet Processing/Trigger data 12_N, sheet FCT_connector/Trigger data 12_N
Trigger data12_P: sheet Processing/Trigger data 12_P, sheet FCT_connector/Trigger data 12_P
Trigger data13_N: sheet Processing/Trigger data 13_N, sheet FCT_connector/Trigger data 13_N
Trigger data13_P: sheet Processing/Trigger data 13_P, sheet FCT_connector/Trigger data 13_P
Trigger data14_N: sheet Processing/Trigger data 14_N, sheet FCT_connector/Trigger data 14_N
Trigger data14_P: sheet Processing/Trigger data 14_P, sheet FCT_connector/Trigger data 14_P
Trigger data15_N: sheet Processing/Trigger data 15_N, sheet FCT_connector/Trigger data 15_N
Trigger data15_P: sheet Processing/Trigger data 15_P, sheet FCT_connector/Trigger data 15_P
Trigger data16_N: sheet Processing/Trigger data 16_N, sheet FCT_connector/Trigger data 16_N
Trigger data16_P: sheet Processing/Trigger data 16_P, sheet FCT_connector/Trigger data 16_P
Trigger data17_N: sheet Processing/Trigger data 17_N, sheet FCT_connector/Trigger data 17_N
Trigger data17_P: sheet Processing/Trigger data 17_P, sheet FCT_connector/Trigger data 17_P
Trigger data18_N: sheet Processing/Trigger data 18_N, sheet FCT_connector/Trigger data 18_N
Trigger data18_P: sheet Processing/Trigger data 18_P, sheet FCT_connector/Trigger data 18_P
Trigger data19_N: sheet Processing/Trigger data 19_N, sheet FCT_connector/Trigger data 19_N
Trigger data19_P: sheet Processing/Trigger data 19_P, sheet FCT_connector/Trigger data 19_P
Trigger data20_N: sheet Processing/Trigger data 20_N, sheet FCT_connector/Trigger data 20_N
Trigger data20_P: sheet Processing/Trigger data 20_P, sheet FCT_connector/Trigger data 20_P
Trigger data21_N: sheet Processing/Trigger data 21_N, sheet FCT_connector/Trigger data 21_N
Trigger data21_P: sheet Processing/Trigger data 21_P, sheet FCT_connector/Trigger data 21_P
Trigger data22_N: sheet Processing/Trigger data 22_N, sheet FCT_connector/Trigger data 22_N
Trigger data22_P: sheet Processing/Trigger data 22_P, sheet FCT_connector/Trigger data 22_P
Trigger data23_N: sheet Processing/Trigger data 23_N, sheet FCT_connector/Trigger data 23_N
Trigger data23_P: sheet Processing/Trigger data 23_P, sheet FCT_connector/Trigger data 23_P
Trigger data24_N: sheet Processing/Trigger data 24_N, sheet FCT_connector/Trigger data 24_N
Trigger data24_P: sheet Processing/Trigger data 24_P, sheet FCT_connector/Trigger data 24_P
Trigger data25_N: sheet Processing/Trigger data 25_N, sheet FCT_connector/Trigger data 25_N
Trigger data25_P: sheet Processing/Trigger data 25_P, sheet FCT_connector/Trigger data 25_P
Trigger data26_N: sheet Processing/Trigger data 26_N, sheet FCT_connector/Trigger data 26_N
Trigger data26_P: sheet Processing/Trigger data 26_P, sheet FCT_connector/Trigger data 26_P
Trigger data27_N: sheet Processing/Trigger data 27_N, sheet FCT_connector/Trigger data 27_N
Trigger data27_P: sheet Processing/Trigger data 27_P, sheet FCT_connector/Trigger data 27_P
Trigger data28_N: sheet Processing/Trigger data 28_N, sheet FCT_connector/Trigger data 28_N
Trigger data28_P: sheet Processing/Trigger data 28_P, sheet FCT_connector/Trigger data 28_P
Trigger data29_N: sheet Processing/Trigger data 29_N, sheet FCT_connector/Trigger data 29_N
Trigger data29_P: sheet Processing/Trigger data 29_P, sheet FCT_connector/Trigger data 29_P
Trigger data30_N: sheet Processing/Trigger data 30_N, sheet FCT_connector/Trigger data 30_N
Trigger data30_P: sheet Processing/Trigger data 30_P, sheet FCT_connector/Trigger data 30_P
Trigger data31_N: sheet Processing/Trigger data 31_N, sheet FCT_connector/Trigger data 31_N
Trigger data31_P: sheet Processing/Trigger data 31_P, sheet FCT_connector/Trigger data 31_P
Trigger data32_N: sheet Processing/Trigger data 32_N, sheet FCT_connector/Trigger data 32_N
Trigger data32_P: sheet Processing/Trigger data 32_P, sheet FCT_connector/Trigger data 32_P
Trigger data33_N: sheet Processing/Trigger data 33_N, sheet FCT_connector/Trigger data 33_N
Trigger data33_P: sheet Processing/Trigger data 33_P, sheet FCT_connector/Trigger data 33_P
Trigger data34_N: sheet Processing/Trigger data 34_N, sheet FCT_connector/Trigger data 34_N
Trigger data34_P: sheet Processing/Trigger data 34_P, sheet FCT_connector/Trigger data 34_P
Trigger data35_N: sheet Processing/Trigger data 35_N, sheet FCT_connector/Trigger data 35_N
Trigger data35_P: sheet Processing/Trigger data 35_P, sheet FCT_connector/Trigger data 35_P
Trigger data36_N: sheet Processing/Trigger data 36_N, sheet FCT_connector/Trigger data 36_N
Trigger data36_P: sheet Processing/Trigger data 36_P, sheet FCT_connector/Trigger data 36_P
Trigger data37_N: sheet Processing/Trigger data 37_N, sheet FCT_connector/Trigger data 37_N
Trigger data37_P: sheet Processing/Trigger data 37_P, sheet FCT_connector/Trigger data 37_P
Trigger data38_N: sheet Processing/Trigger data 38_N, sheet FCT_connector/Trigger data 38_N
Trigger data38_P: sheet Processing/Trigger data 38_P, sheet FCT_connector/Trigger data 38_P
Trigger data39_N: sheet Processing/Trigger data 39_N, sheet FCT_connector/Trigger data 39_N
Trigger data39_P: sheet Processing/Trigger data 39_P, sheet FCT_connector/Trigger data 39_P
Trigger data40_N: sheet Processing/Trigger data 40_N, sheet FCT_connector/Trigger data 40_N
Trigger data40_P: sheet Processing/Trigger data 40_P, sheet FCT_connector/Trigger data 40_P
Trigger data41_N: sheet Processing/Trigger data 41_N, sheet FCT_connector/Trigger data 41_N
Trigger data41_P: sheet Processing/Trigger data 41_P, sheet FCT_connector/Trigger data 41_P
Trigger data42_N: sheet Processing/Trigger data 42_N, sheet FCT_connector/Trigger data 42_N
Trigger data42_P: sheet Processing/Trigger data 42_P, sheet FCT_connector/Trigger data 42_P
Trigger data43_N: sheet Processing/Trigger data 43_N, sheet FCT_connector/Trigger data 43_N
Trigger data43_P: sheet Processing/Trigger data 43_P, sheet FCT_connector/Trigger data 43_P
Trigger data44_N: sheet Processing/Trigger data 44_N, sheet FCT_connector/Trigger data 44_N
Trigger data44_P: sheet Processing/Trigger data 44_P, sheet FCT_connector/Trigger data 44_P
Trigger data45_N: sheet Processing/Trigger data 45_N, sheet FCT_connector/Trigger data 45_N
Trigger data45_P: sheet Processing/Trigger data 45_P, sheet FCT_connector/Trigger data 45_P
Trigger data46_N: sheet Processing/Trigger data 46_N, sheet FCT_connector/Trigger data 46_N
Trigger data46_P: sheet Processing/Trigger data 46_P, sheet FCT_connector/Trigger data 46_P
Trigger data47_N: sheet Processing/Trigger data 47_N, sheet FCT_connector/Trigger data 47_N
Trigger data47_P: sheet Processing/Trigger data 47_P, sheet FCT_connector/Trigger data 47_P
Trigger data48_N: sheet Processing/Trigger data 48_N, sheet FCT_connector/Trigger data 48_N
Trigger data48_P: sheet Processing/Trigger data 48_P, sheet FCT_connector/Trigger data 48_P
Trigger data49_N: sheet Processing/Trigger data 49_N, sheet FCT_connector/Trigger data 49_N
Trigger data49_P: sheet Processing/Trigger data 49_P, sheet FCT_connector/Trigger data 49_P
Trigger data50_N: sheet Processing/Trigger data 50_N, sheet FCT_connector/Trigger data 50_N
Trigger data50_P: sheet Processing/Trigger data 50_P, sheet FCT_connector/Trigger data 50_P
Trigger data51_N: sheet Processing/Trigger data 51_N, sheet FCT_connector/Trigger data 51_N
Trigger data51_P: sheet Processing/Trigger data 51_P, sheet FCT_connector/Trigger data 51_P
Trigger data52_N: sheet Processing/Trigger data 52_N, sheet FCT_connector/Trigger data 52_N
Trigger data52_P: sheet Processing/Trigger data 52_P, sheet FCT_connector/Trigger data 52_P
Trigger data53_N: sheet Processing/Trigger data 53_N, sheet FCT_connector/Trigger data 53_N
Trigger data53_P: sheet Processing/Trigger data 53_P, sheet FCT_connector/Trigger data 53_P
Trigger data54_N: sheet Processing/Trigger data 54_N, sheet FCT_connector/Trigger data 54_N
Trigger data54_P: sheet Processing/Trigger data 54_P, sheet FCT_connector/Trigger data 54_P
Trigger data55_N: sheet Processing/Trigger data 55_N, sheet FCT_connector/Trigger data 55_N
Trigger data55_P: sheet Processing/Trigger data 55_P, sheet FCT_connector/Trigger data 55_P
Trigger data56_N: sheet Processing/Trigger data 56_N, sheet FCT_connector/Trigger data 56_N
Trigger data56_P: sheet Processing/Trigger data 56_P, sheet FCT_connector/Trigger data 56_P
Trigger data57_N: sheet Processing/Trigger data 57_N, sheet FCT_connector/Trigger data 57_N
Trigger data57_P: sheet Processing/Trigger data 57_P, sheet FCT_connector/Trigger data 57_P
Trigger data58_N: sheet Processing/Trigger data 58_N, sheet FCT_connector/Trigger data 58_N
Trigger data58_P: sheet Processing/Trigger data 58_P, sheet FCT_connector/Trigger data 58_P
Trigger data59_N: sheet Processing/Trigger data 59_N, sheet FCT_connector/Trigger data 59_N
Trigger data59_P: sheet Processing/Trigger data 59_P, sheet FCT_connector/Trigger data 59_P
Trigger data60_N: sheet Processing/Trigger data 60_N, sheet FCT_connector/Trigger data 60_N
Trigger data60_P: sheet Processing/Trigger data 60_P, sheet FCT_connector/Trigger data 60_P
Trigger data61_N: sheet Processing/Trigger data 61_N, sheet FCT_connector/Trigger data 61_N
Trigger data61_P: sheet Processing/Trigger data 61_P, sheet FCT_connector/Trigger data 61_P
Trigger data62_N: sheet Processing/Trigger data 62_N, sheet FCT_connector/Trigger data 62_N
Trigger data62_P: sheet Processing/Trigger data 62_P, sheet FCT_connector/Trigger data 62_P
Trigger data63_N: sheet Processing/Trigger data 63_N, sheet FCT_connector/Trigger data 63_N
Trigger data63_P: sheet Processing/Trigger data 63_P, sheet FCT_connector/Trigger data 63_P
Trigger data64_N: sheet Processing/Trigger data 64_N, sheet FCT_connector/Trigger data 64_N
Trigger data64_P: sheet Processing/Trigger data 64_P, sheet FCT_connector/Trigger data 64_P
Trigger_N: sheet Processing/Trigger_N, sheet FCT_connector/Trigger_N
Trigger_P: sheet Processing/Trigger_P, sheet FCT_connector/Trigger_P
TX_CLK: sheet Processing/TX_CLK, sheet Ethernet/TX_CLK
TX_EN: sheet Processing/TX_EN, sheet Ethernet/TX_EN
NetCLED2_1: CLED2.1 RLED1.1 VDLED2.CATH
NetCLED3_1: CLED3.1 RLED2.1 VDLED1.CATH
NetCLED4_1: CLED4.1 RLED3.1 VDLED3.CATH

### Buses and harness runs
bus DCO_N_[1..32] = sheet Processing/DCO_N_[1..32]
bus DCO_P_[1..32] = sheet Processing/DCO_P_[1..32]
bus FCO_N_[1..32] = sheet Processing/FCO_N_[1..32]
bus FCO_P_[1..32] = sheet Processing/FCO_P_[1..32]
bus RXD[3..0] = sheet Ethernet/RXD[3..0]
bus RXD[3..0] = sheet Processing/RXD[3..0]
bus TXD[3..0] = sheet Ethernet/TXD[3..0]
bus TXD[3..0] = sheet Processing/TXD[3..0]

### Layout directives
differential pair: (no net found under the mark), ADC_DOWN_CLK_N, ADC_DOWN_CLK_P, ADC_UP_CLK_N, ADC_UP_CLK_P, Beam time_N, Beam time_P, Busy_N, Busy_P, DCO_N_1, DCO_N_2, DCO_N_3, DCO_N_4, DCO_N_5, DCO_N_6, DCO_N_7, DCO_N_8, DCO_N_9, DCO_N_10, DCO_N_11, DCO_N_12, DCO_N_13, DCO_N_14, DCO_N_15, DCO_N_16, DCO_N_17, DCO_N_18, DCO_N_19, DCO_N_20, DCO_N_21, DCO_N_22, DCO_N_23, DCO_N_24, DCO_N_25, DCO_N_26, DCO_N_27, DCO_N_28, DCO_N_29, DCO_N_30, DCO_N_31, DCO_N_32, DCO_P_1, DCO_P_2, DCO_P_3, DCO_P_4, DCO_P_5, DCO_P_6, DCO_P_7, DCO_P_8, DCO_P_9, DCO_P_10, DCO_P_11, DCO_P_12, DCO_P_13, DCO_P_14, DCO_P_15, DCO_P_16, DCO_P_17, DCO_P_18, DCO_P_19, DCO_P_20, DCO_P_21, DCO_P_22, DCO_P_23, DCO_P_24, DCO_P_25, DCO_P_26, DCO_P_27, DCO_P_28, DCO_P_29, DCO_P_30, DCO_P_31, DCO_P_32, FCO_N_1, FCO_N_2, FCO_N_3, FCO_N_4, FCO_N_5, FCO_N_6, FCO_N_7, FCO_N_8, FCO_N_9, FCO_N_10, FCO_N_11, FCO_N_12, FCO_N_13, FCO_N_14, FCO_N_15, FCO_N_16, FCO_N_17, FCO_N_18, FCO_N_19, FCO_N_20, FCO_N_21, FCO_N_22, FCO_N_23, FCO_N_24, FCO_N_25, FCO_N_26, FCO_N_27, FCO_N_28, FCO_N_29, FCO_N_30, FCO_N_31, FCO_N_32, FCO_Next_N, FCO_Next_P, FCO_P_1, FCO_P_2, FCO_P_3, FCO_P_4, FCO_P_5, FCO_P_6, FCO_P_7, FCO_P_8, FCO_P_9, FCO_P_10, FCO_P_11, FCO_P_12, FCO_P_13, FCO_P_14, FCO_P_15, FCO_P_16, FCO_P_17, FCO_P_18, FCO_P_19, FCO_P_20, FCO_P_21, FCO_P_22, FCO_P_23, FCO_P_24, FCO_P_25, FCO_P_26, FCO_P_27, FCO_P_28, FCO_P_29, FCO_P_30, FCO_P_31, FCO_P_32, FCO_Prev_N, FCO_Prev_P, FCT_CLK_40MHz_N, FCT_CLK_40MHz_P, FCT_CLK_160MHz_N, FCT_CLK_160MHz_P, Hard reset_N, Hard reset_P, NextCh1_N, NextCh1_P, NextCh2_N, NextCh2_P, NextCh3_N, NextCh3_P, NextCh4_N, NextCh4_P, NextCh5_N, NextCh5_P, NextCh6_N, NextCh6_P, NextCh7_N, NextCh7_P, NextCh8_N, NextCh8_P, NextCh9_N, NextCh9_P, NextCh10_N, NextCh10_P, NextCh11_N, NextCh11_P, NextCh12_N, NextCh12_P, Part1_InputCh1_N, Part1_InputCh1_P, Part1_InputCh2_N, Part1_InputCh2_P, Part1_InputCh3_N, Part1_InputCh3_P, Part1_InputCh4_N, Part1_InputCh4_P, Part1_InputCh5_N, Part1_InputCh5_P, Part1_InputCh6_N, Part1_InputCh6_P, Part1_InputCh7_N, Part1_InputCh7_P, Part1_InputCh8_N, Part1_InputCh8_P, Part2_InputCh1_N, Part2_InputCh1_P, Part2_InputCh2_N, Part2_InputCh2_P, Part2_InputCh3_N, Part2_InputCh3_P, Part2_InputCh4_N, Part2_InputCh4_P, Part2_InputCh5_N, Part2_InputCh5_P, Part2_InputCh6_N, Part2_InputCh6_P, Part2_InputCh7_N, Part2_InputCh7_P, Part2_InputCh8_N, Part2_InputCh8_P, Part3_InputCh1_N, Part3_InputCh1_P, Part3_InputCh2_N, Part3_InputCh2_P, Part3_InputCh3_N, Part3_InputCh3_P, Part3_InputCh4_N, Part3_InputCh4_P, Part3_InputCh5_N, Part3_InputCh5_P, Part3_InputCh6_N, Part3_InputCh6_P, Part3_InputCh7_N, Part3_InputCh7_P, Part3_InputCh8_N, Part3_InputCh8_P, Part4_InputCh1_N, Part4_InputCh1_P, Part4_InputCh2_N, Part4_InputCh2_P, Part4_InputCh3_N, Part4_InputCh3_P, Part4_InputCh4_N, Part4_InputCh4_P, Part4_InputCh5_N, Part4_InputCh5_P, Part4_InputCh6_N, Part4_InputCh6_P, Part4_InputCh7_N, Part4_InputCh7_P, Part4_InputCh8_N, Part4_InputCh8_P, Part5_InputCh1_N, Part5_InputCh1_P, Part5_InputCh2_N, Part5_InputCh2_P, Part5_InputCh3_N, Part5_InputCh3_P, Part5_InputCh4_N, Part5_InputCh4_P, Part5_InputCh5_N, Part5_InputCh5_P, Part5_InputCh6_N, Part5_InputCh6_P, Part5_InputCh7_N, Part5_InputCh7_P, Part5_InputCh8_N, Part5_InputCh8_P, Part6_InputCh1_N, Part6_InputCh1_P, Part6_InputCh2_N, Part6_InputCh2_P, Part6_InputCh3_N, Part6_InputCh3_P, Part6_InputCh4_N, Part6_InputCh4_P, Part6_InputCh5_N, Part6_InputCh5_P, Part6_InputCh6_N, Part6_InputCh6_P, Part6_InputCh7_N, Part6_InputCh7_P, Part6_InputCh8_N, Part6_InputCh8_P, Part7_InputCh1_N, Part7_InputCh1_P, Part7_InputCh2_N, Part7_InputCh2_P, Part7_InputCh3_N, Part7_InputCh3_P, Part7_InputCh4_N, Part7_InputCh4_P, Part7_InputCh5_N, Part7_InputCh5_P, Part7_InputCh6_N, Part7_InputCh6_P, Part7_InputCh7_N, Part7_InputCh7_P, Part7_InputCh8_N, Part7_InputCh8_P, Part8_InputCh1_N, Part8_InputCh1_P, Part8_InputCh2_N, Part8_InputCh2_P, Part8_InputCh3_N, Part8_InputCh3_P, Part8_InputCh4_N, Part8_InputCh4_P, Part8_InputCh5_N, Part8_InputCh5_P, Part8_InputCh6_N, Part8_InputCh6_P, Part8_InputCh7_N, Part8_InputCh7_P, Part8_InputCh8_N, Part8_InputCh8_P, Part9_InputCh1_N, Part9_InputCh1_P, Part9_InputCh2_N, Part9_InputCh2_P, Part9_InputCh3_N, Part9_InputCh3_P, Part9_InputCh4_N, Part9_InputCh4_P, Part9_InputCh5_N, Part9_InputCh5_P, Part9_InputCh6_N, Part9_InputCh6_P, Part9_InputCh7_N, Part9_InputCh7_P, Part9_InputCh8_N, Part9_InputCh8_P, Part10_InputCh1_N, Part10_InputCh1_P, Part10_InputCh2_N, Part10_InputCh2_P, Part10_InputCh3_N, Part10_InputCh3_P, Part10_InputCh4_N, Part10_InputCh4_P, Part10_InputCh5_N, Part10_InputCh5_P, Part10_InputCh6_N, Part10_InputCh6_P, Part10_InputCh7_N, Part10_InputCh7_P, Part10_InputCh8_N, Part10_InputCh8_P, Part11_InputCh1_N, Part11_InputCh1_P, Part11_InputCh2_N, Part11_InputCh2_P, Part11_InputCh3_N, Part11_InputCh3_P, Part11_InputCh4_N, Part11_InputCh4_P, Part11_InputCh5_N, Part11_InputCh5_P, Part11_InputCh6_N, Part11_InputCh6_P, Part11_InputCh7_N, Part11_InputCh7_P, Part11_InputCh8_N, Part11_InputCh8_P, Part12_InputCh1_N, Part12_InputCh1_P, Part12_InputCh2_N, Part12_InputCh2_P, Part12_InputCh3_N, Part12_InputCh3_P, Part12_InputCh4_N, Part12_InputCh4_P, Part12_InputCh5_N, Part12_InputCh5_P, Part12_InputCh6_N, Part12_InputCh6_P, Part12_InputCh7_N, Part12_InputCh7_P, Part12_InputCh8_N, Part12_InputCh8_P, Part13_InputCh1_N, Part13_InputCh1_P, Part13_InputCh2_N, Part13_InputCh2_P, Part13_InputCh3_N, Part13_InputCh3_P, Part13_InputCh4_N, Part13_InputCh4_P, Part13_InputCh5_N, Part13_InputCh5_P, Part13_InputCh6_N, Part13_InputCh6_P, Part13_InputCh7_N, Part13_InputCh7_P, Part13_InputCh8_N, Part13_InputCh8_P, Part14_InputCh1_N, Part14_InputCh1_P, Part14_InputCh2_N, Part14_InputCh2_P, Part14_InputCh3_N, Part14_InputCh3_P, Part14_InputCh4_N, Part14_InputCh4_P, Part14_InputCh5_N, Part14_InputCh5_P, Part14_InputCh6_N, Part14_InputCh6_P, Part14_InputCh7_N, Part14_InputCh7_P, Part14_InputCh8_N, Part14_InputCh8_P, Part15_InputCh1_N, Part15_InputCh1_P, Part15_InputCh2_N, Part15_InputCh2_P, Part15_InputCh3_N, Part15_InputCh3_P, Part15_InputCh4_N, Part15_InputCh4_P, Part15_InputCh5_N, Part15_InputCh5_P, Part15_InputCh6_N, Part15_InputCh6_P, Part15_InputCh7_N, Part15_InputCh7_P, Part15_InputCh8_N, Part15_InputCh8_P, Part16_InputCh1_N, Part16_InputCh1_P, Part16_InputCh2_N, Part16_InputCh2_P, Part16_InputCh3_N, Part16_InputCh3_P, Part16_InputCh4_N, Part16_InputCh4_P, Part16_InputCh5_N, Part16_InputCh5_P, Part16_InputCh6_N, Part16_InputCh6_P, Part16_InputCh7_N, Part16_InputCh7_P, Part16_InputCh8_N, Part16_InputCh8_P, Pre Beam time_N, Pre Beam time_P, PrevCh1_N, PrevCh1_P, PrevCh2_N, PrevCh2_P, PrevCh3_N, PrevCh3_P, PrevCh4_N, PrevCh4_P, PrevCh5_N, PrevCh5_P, PrevCh6_N, PrevCh6_P, PrevCh7_N, PrevCh7_P, PrevCh8_N, PrevCh8_P, PrevCh9_N, PrevCh9_P, PrevCh10_N, PrevCh10_P, PrevCh11_N, PrevCh11_P, PrevCh12_N, PrevCh12_P, Signal Window_N, Signal Window_P, Status IN 1_N, Status IN 1_P, Status IN 2_N, Status IN 2_P, Status IN 3_N, Status IN 3_P, Status IN 4_N, Status IN 4_P, Trigger data1_N, Trigger data1_P, Trigger data2_N, Trigger data2_P, Trigger data3_N, Trigger data3_P, Trigger data4_N, Trigger data4_P, Trigger data5_N, Trigger data5_P, Trigger data6_N, Trigger data6_P, Trigger data7_N, Trigger data7_P, Trigger data8_N, Trigger data8_P, Trigger data9_N, Trigger data9_P, Trigger data10_N, Trigger data10_P, Trigger data11_N, Trigger data11_P, Trigger data12_N, Trigger data12_P, Trigger data13_N, Trigger data13_P, Trigger data14_N, Trigger data14_P, Trigger data15_N, Trigger data15_P, Trigger data16_N, Trigger data16_P, Trigger data17_N, Trigger data17_P, Trigger data18_N, Trigger data18_P, Trigger data19_N, Trigger data19_P, Trigger data20_N, Trigger data20_P, Trigger data21_N, Trigger data21_P, Trigger data22_N, Trigger data22_P, Trigger data23_N, Trigger data23_P, Trigger data24_N, Trigger data24_P, Trigger data25_N, Trigger data25_P, Trigger data26_N, Trigger data26_P, Trigger data27_N, Trigger data27_P, Trigger data28_N, Trigger data28_P, Trigger data29_N, Trigger data29_P, Trigger data30_N, Trigger data30_P, Trigger data31_N, Trigger data31_P, Trigger data32_N, Trigger data32_P, Trigger data33_N, Trigger data33_P, Trigger data34_N, Trigger data34_P, Trigger data35_N, Trigger data35_P, Trigger data36_N, Trigger data36_P, Trigger data37_N, Trigger data37_P, Trigger data38_N, Trigger data38_P, Trigger data39_N, Trigger data39_P, Trigger data40_N, Trigger data40_P, Trigger data41_N, Trigger data41_P, Trigger data42_N, Trigger data42_P, Trigger data43_N, Trigger data43_P, Trigger data44_N, Trigger data44_P, Trigger data45_N, Trigger data45_P, Trigger data46_N, Trigger data46_P, Trigger data47_N, Trigger data47_P, Trigger data48_N, Trigger data48_P, Trigger data49_N, Trigger data49_P, Trigger data50_N, Trigger data50_P, Trigger data51_N, Trigger data51_P, Trigger data52_N, Trigger data52_P, Trigger data53_N, Trigger data53_P, Trigger data54_N, Trigger data54_P, Trigger data55_N, Trigger data55_P, Trigger data56_N, Trigger data56_P, Trigger data57_N, Trigger data57_P, Trigger data58_N, Trigger data58_P, Trigger data59_N, Trigger data59_P, Trigger data60_N, Trigger data60_P, Trigger data61_N, Trigger data61_P, Trigger data62_N, Trigger data62_P, Trigger data63_N, Trigger data63_P, Trigger data64_N, Trigger data64_P, Trigger_N, Trigger_P

### Notes on the sheet
- Green
- Blue
- (near VDLED3) RED

### Library data of the parts
CLED1-CLED4 = C: Text Field1: 20; Text Field2: 10
FastTrig1 TrigDes1 = LEMO: Text Field1: 20; Text Field2: 20
RLED1-RLED3 = R: Text Field1: 20; Text Field2: 20
S1-S6 = SW-SPST: Single-Pole, Single-Throw Switch; Published: 24-Mar-1999; LatestRevisionDate: 17-Jul-2002; LatestRevisionNote: Re-released for DXP Platform.; PackageReference: SPST-2; Publisher: Altium Limited; PackageDescription: Switch; 2 Leads
VDLED1-VDLED3 = AL307: Text Field1: 10; Text Field2: 30